# EAGLE schematic testBoard (EAGLE 8.6.0)
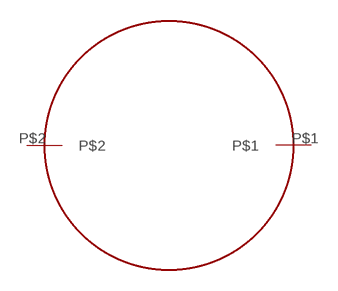
[diagram p0: schematic, sheet 1]

## Parts
U$1  AIYIMA-PUMP-A5F083  [A5F083]
Unconnected: U$1.P$1 U$1.P$2

## Library data of the parts
U$1 = programmable-air-components:AIYIMA-PUMP-A5F083: Aiyima company vacuum/high pressure air pump. 12V, 0.35A, 3LPM